# EAGLE design blinkm_mk2v5 (EAGLE 6.6.0)
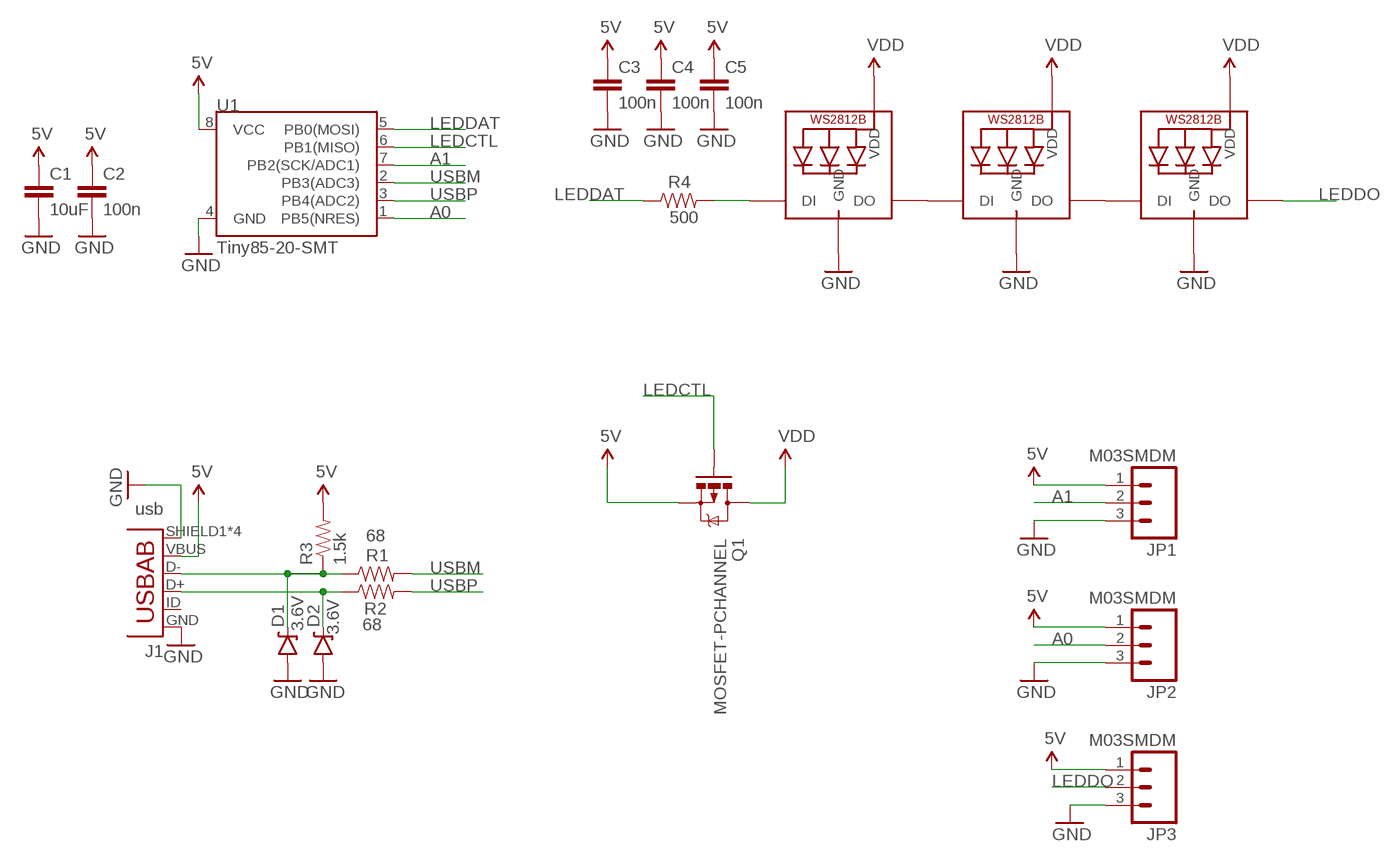
[diagram p0: schematic, sheet 1]

## Parts
C1  10uF  CAP0603-CAP  [0603-CAP]
C2  100n  CAP0603-CAP  [0603-CAP]
C3  100n  CAP0603-CAP  [0603-CAP]
C4  100n  CAP0603-CAP  [0603-CAP]
C5  100n  CAP0603-CAP  [0603-CAP]
D1  3.6V  DIODE-ZENER3.3V  [SOD-323]
D2  3.6V  DIODE-ZENER3.3V  [SOD-323]
J1  usb  USB-AB  [USB-AB-MICRO-SMD]
JP1  M03SMDM  [1X03-SMD-MINIMAL]
JP2  M03SMDM  [1X03-SMD-MINIMAL]
JP3  M03SMDM  [1X03-SMD-MINIMAL]
LED1  WS2812B3535  [LED3535]
LED2  WS2812B3535  [LED3535]
LED3  WS2812B3535  [LED3535]
Q1  MOSFET-PCHANNEL  [SOT23-3]
R1  68  RESISTOR0603-RES  [0603-RES]
R2  68  RESISTOR0603-RES  [0603-RES]
R3  1.5k  RESISTOR0603-RES  [0603-RES]
R4  500  RESISTOR0603-RES  [0603-RES]
U1  Tiny85-20-SMT  ATTINY45TINY85-20-SMT  [SO08-EIAJ]

## Nets
5V: C1.1 C2.1 C3.1 C4.1 C5.1 J1.VBUS JP1.1 JP2.1 JP3.1 Q1.2(S) R3.2 U1.8(VCC)
A0: JP2.2 U1.1(PB5(NRES))
A1: JP1.2 U1.7(PB2(SCK/ADC1))
GND: C1.2 C2.2 C3.2 C4.2 C5.2 D1.A D2.A J1.GND J1.SHIELD1(SHIELD) J1.SHIELD2(SHIELD) J1.SHIELD3(SHIELD) J1.SHIELD4(SHIELD) JP1.3 JP2.3 JP3.3 LED1.4(GND) LED2.4(GND) LED3.4(GND) U1.4(GND)
LEDCTL: Q1.1(G) U1.6(PB1(MISO))
LEDDAT: R4.1 U1.5(PB0(MOSI))
LEDDO: JP3.2 LED3.3(DO)
N$1: LED1.3(DO) LED2.1(DI)
N$2: LED2.3(DO) LED3.1(DI)
N$3: D1.C J1.D- R1.1 R3.1
N$4: D2.C J1.D+ R2.1
N$5: LED1.1(DI) R4.2
USBM: R1.2 U1.2(PB3(ADC3))
USBP: R2.2 U1.3(PB4(ADC2))
VDD: LED1.2(VDD) LED2.2(VDD) LED3.2(VDD) Q1.3(D)
Unconnected: J1.ID(USBID)

## Library data of the parts
C1-C5 = SparkFun-Capacitors:CAP: Capacitor Standard 0603 ceramic capacitor, and 0.1" leaded capacitor.
D1 D2 = SparkFun-DiscreteSemi:DIODE-ZENER: Zener Diode Production Part - 8199 3.4V Zener Voltage; PROD_ID: DIO-11284; VALUE: 3.3V
J1 = SparkFun-Connectors:USB-AB: This is a USB AB connector that is compatible with USB OTG. i.e. this connector can serve as a host or device
JP1-JP3 = todstuff:M03
LED1-LED3 = adafruit:WS2812B
Q1 = SparkFun-DiscreteSemi:MOSFET-PCHANNEL: Generic PMOSFET IRLML2244 - TRANS-11153 (SOT-23 -20V -4.3A) (1.Gate 2.Source 3.Drain) FQP27P06 - COM-10349 <http://www.sparkfun.com/products/10349> (TO-220 -60V -27A) (1.Gate 2.Source 3.Drain); PROD_ID: TRANS-08285
R1-R4 = SparkFun-Passives:RESISTOR: Resistor Basic schematic elements and footprints for 0603, 1206, and PTH resistors.
U1 = SparkFun-DigitalIC:ATTINY45: Atmel 8-pin 2/4/8kB flash uC; PROD_ID: IC-09092

## Board
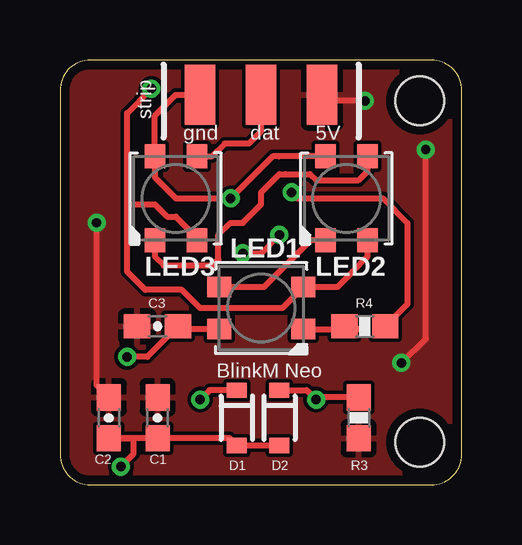
[diagram p1: board, top side]
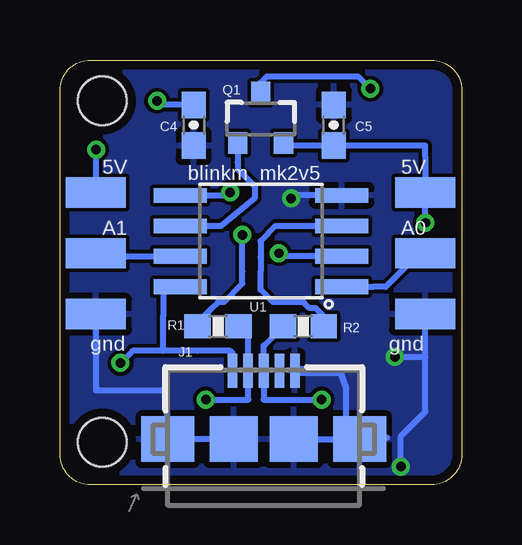
[diagram p2: board, bottom side, seen from below]

Size 16.74 x 17.7 mm. Coordinates in mm from the lower left corner, seen from the top.
Outline: 0,16.43 0,1.27 arc90 1.27,0 15.47,0 arc90 16.74,1.27 16.74,16.43 arc90 15.47,17.7 1.27,17.7 arc90 0,16.43
Copper layers (1*16): Top 0.0356mm / dielectric 1.5011mm / Bottom 0.0356mm
Design rules "LaenPCBOrder *": minimum track width 6mil, minimum drill 13mil, track to track 6mil, track to pad 6mil, pad to pad 6mil, via to via 6mil, smd to smd 6mil, copper to edge 15mil, drill to drill 6mil, minimum pad ring 7mil, minimum via ring 7mil, stop-mask expansion 3mil, vias tented up to drill 20mil, thermal gap 10mil
Holes 2.03 mm at 14.99,1.78 14.99,16

### Footprints (pad centres in the part's own frame; a part is rotated, then mirrored left to right if it is on the bottom)
0603-CAP = smd 1.1 x 1: 1 -0.85,0; 2 0.85,0
SOD-323 = smd 0.63 x 0.83: A 1.15,0; C -1.15,0
USB-AB-MICRO-SMD = smd 1.4 x 0.4: D+ 2.85,0; D- 2.85,0.65; GND 2.85,-1.3; ID 2.85,-0.65; VBUS 2.85,1.3 | smd 1.9 x 2.2: SHIELD1 0,4; SHIELD4 0,-4 | smd 1.9 x 2: SHIELD2 0,1.25; SHIELD3 0,-1.25
1X03-SMD-MINIMAL = smd 1.27 x 2.5: 1 -2.54,-0.01; 2 0,-0.01; 3 2.54,-0.01
LED3535 = smd 1 x 0.85: 1 -1.75,0.875; 2 -1.75,-0.875; 3 1.75,-0.875; 4 1.75,0.875
SOT23-3 = smd 0.8 x 0.9: 1 -0.95,-1; 2 0.95,-1; 3 0,1.1
0603-RES = smd 1.1 x 1: 1 -0.85,0; 2 0.85,0
SO08-EIAJ = smd 0.61 x 2.21: 1 -1.905,-3.378; 2 -0.635,-3.378; 3 0.635,-3.378; 4 1.905,-3.378; 5 1.905,3.353; 6 0.635,3.353; 7 -0.635,3.353; 8 -1.905,3.353

### Placement (x,y rotation side)
C1  4.06,2.79 270 top
C2  2.03,2.79 270 top
C3  4.06,6.6 0 top
C4  11.18,14.99 270 bottom
C5  5.33,14.99 90 bottom
D1  9.14,2.79 270 top
D2  7.37,2.79 270 top
J1  8.26,1.91 90 bottom
JP1  15.24,9.65 270 bottom
JP2  1.52,9.65 270 bottom
JP3  8.38,16.26 180 top
LED1  8.38,7.37 180 top
LED2  11.94,11.94 90 top
LED3  4.83,11.94 90 top
Q1  8.38,15.24 0 bottom
R1  10.16,6.6 180 bottom
R2  6.6,6.6 0 bottom
R3  12.45,2.79 270 top
R4  12.7,6.6 180 top
U1  8.38,10.16 90 bottom

### Tracks (layer width: path | path; a pad name or v marks a point on that pad's centre or on a via)
5V  (via drill 0.39)
  Top 0.254: 1.52,4.66 1.52,5.08 | 1.52,5.08 v1.52,10.92 | v14.22,5.08 15.24,6.1 v15.24,13.97 | 10.92,16 JP3.1 10.92,16 | C2.1 1.52,4.15 1.52,5.08 | v12.7,16 10.92,16
  Bottom 0.254: 12.45,5.59 11.01,5.59 9.65,5.59 9.55,5.49 J1.VBUS | 12.45,5.59 12.45,7.04 12.45,8.26 U1.8 | v1.52,10.92 1.53,10.93 JP2.1 1.53,13.68 1.53,14.14 C5.1 | v15.24,13.97 v15.25,13.97 JP1.1 | 12.45,5.59 13.72,5.59 v14.22,5.08 | C5.1 5.16,14.14 5.08,14.22 | C4.1 12.53,15.84 v12.7,16 | C5.1 7.43,14.14 Q1.2
  pour Top: 0,17.78 17.78,17.78 17.78,0 -2.54,0 -2.54,1.27 -2.54,17.78
A0
  Bottom 0.254: U1.1 3.68,8.26 3.17,8.26 3.05,8.38 1.78,9.65 JP2.2
A1
  Bottom 0.254: JP1.2 15.12,9.53 U1.7
GND  (via drill 0.39)
  Top 0.254: D1.A D2.A 7.07,1.94 C1.2 3.05,1.94 | 3.05,1.94 C2.2 3.05,1.94 | 3.05,1.94 3.05,1.27 v2.54,0.76 | LED2.4 9.12,13.69 8.86,13.69 v7.11,11.94 6.6,11.94 4.83,11.94 4.32,12.45 3.95,12.81 LED3.4 3.95,15.38 4.83,16.26 5.83,16.26 JP3.3 | LED1.4 4.71,6.49 | 4.71,6.49 4.57,6.49 | 4.57,6.49 4.71,6.49 | v2.79,5.33 3.64,5.33 C3.2 4.8,6.49 4.57,6.49
  Bottom 0.254: J1.SHIELD3 J1.SHIELD4 4.83,1.97 | J1.SHIELD2 J1.SHIELD1 12.32,3.94 15.24,3.94 15.24,4.06 JP1.3 | 5.08,4.75 4.83,3.99 4.83,1.97 | 4.83,1.97 3.11,1.97 | JP2.3 | U1.4 6.99,12.06 v7.11,11.94 | v2.54,0.76 2.54,2.03 1.52,3.05 1.52,5.33 | 1.52,5.33 JP2.3 | v2.79,5.33 1.52,5.33
  Bottom 0.406: J1.GND 5.08,4.75
  pour Bottom: 0,17.78 17.78,17.78 17.78,0 -1.27,0 -1.27,17.78
LEDCTL
  Bottom 0.254: U1.6 10.03,10.79 8.64,11.94 8.64,12.45 9.33,13.14 9.33,13.4 9.33,13.46 Q1.1
LEDDAT  (via drill 0.39)
  Top 0.254: R4.1 14.48,7.53 14.48,10.41 14.48,10.92 13.46,11.94 9.91,11.94 v9.65,12.19
  Bottom 0.254: U1.5 9.78,12.06 v9.65,12.19
LEDDO
  Top 0.254: LED3.3 6.32,13.69 6.86,14.22 7.87,14.22 8.38,14.73 JP3.2
N$1
  Top 0.254: LED1.3 8.49,8.24 8.89,8.64 10.44,10.19 LED2.1
N$2
  Top 0.254: LED2.3 12.81,13.07 12.45,12.7 10.67,12.7 10.41,12.95 9.4,12.95 9.14,12.95 8.38,12.19 8.38,11.68 7.62,10.92 7.11,10.92 6.6,10.41 6.6,9.4 6.35,9.14 4.74,9.14 4.32,9.14 3.95,9.51 LED3.1
N$3  (via drill 0.39)
  Top 0.254: D1.C 10.28,3.94 v10.67,3.56 10.76,3.64 R3.1
  Bottom 0.254: R1.1 8.9,6.2 J1.D- 8.89,3.56 v10.67,3.56
N$4  (via drill 0.39)
  Top 0.254: D2.C 6.23,3.94 v5.84,3.56
  Bottom 0.254: v5.84,3.56 8.26,3.56 J1.D+ 8.26,5.8 R2.1
N$5
  Top 0.254: LED1.1 12.42,6.49 R4.2
USBM  (via drill 0.39)
  Top 0.254: v7.62,9.65 8.38,9.65 v9.14,10.41
  Bottom 0.254: R1.2 10.92,6.69 10.92,6.86 10.41,7.37 10.16,7.62 9.91,7.62 9.14,8.38 9.14,8.89 v9.14,10.41 | U1.2 7.49,9.53 v7.62,9.65
USBP
  Bottom 0.254: U1.3 7.75,10.79 8.38,10.16 8.38,9.49 8.38,8.89 8.38,8.13 7.87,7.62 6.6,7.62 6.35,7.37 6.1,7.37 5.75,7.02 R2.2
VDD  (via drill 0.39)
  Top 0.254: 2.79,11.94 2.79,11.68 | 2.79,11.68 3.95,11.68 4.46,11.18 4.83,11.18 5.7,10.3 LED3.2 | 2.79,11.68 2.79,10.92 2.79,8.89 3.56,8.13 5.08,8.13 5.84,7.37 9.26,7.37 LED1.2 11.37,8.24 11.54,8.24 12.19,8.89 12.79,9.48 12.81,9.51 LED2.2 | 2.79,11.68 2.79,11.94 | 2.79,11.94 2.79,15.49 v3.81,16.51
  Bottom 0.254: Q1.3 8.38,16.76 8.13,17.02 4.32,17.02 v3.81,16.51

### Text on the board
tPlace: strip | gnd | dat | 5V | BlinkM Neo
bPlace: 5V | blinkm_mk2v5 | 5V | A0 | A1 | gnd | gnd